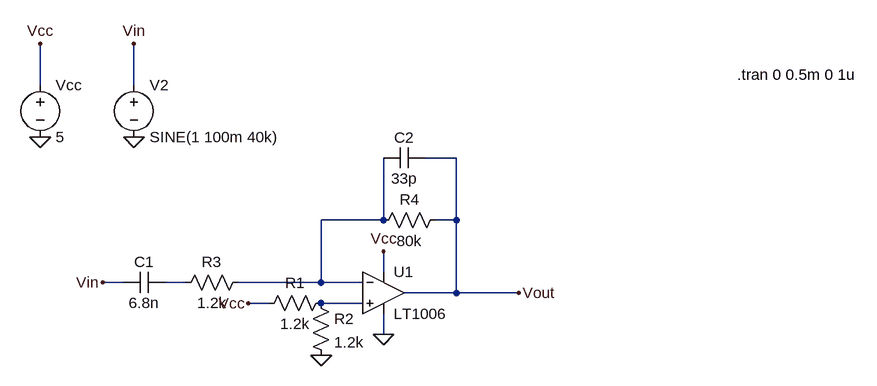
[diagram p0: schematic active_lowpass.asc]
active_lowpass.asc, the LTspice schematic file:
Version 4
SHEET 1 932 680
WIRE -336 96 -336 32
WIRE -192 96 -192 32
WIRE 304 208 256 208
WIRE 192 304 192 208
WIRE 192 304 96 304
WIRE 304 304 304 208
WIRE 304 304 272 304
WIRE 192 384 192 352
WIRE -208 400 -240 400
WIRE -112 400 -144 400
WIRE 96 400 96 304
WIRE 96 400 -32 400
WIRE 160 400 96 400
WIRE 304 416 304 304
WIRE 304 416 224 416
WIRE 400 416 304 416
WIRE 16 432 -16 432
WIRE 160 432 96 432
WIRE 192 480 192 448
FLAG -336 176 0
FLAG -192 176 0
FLAG 96 512 0
FLAG -336 32 Vcc
FLAG -192 32 Vin
FLAG -240 400 Vin
FLAG 400 416 Vout
FLAG 192 352 Vcc
FLAG 192 480 0
FLAG -16 432 Vcc
SYMBOL LT1006 192 352 R0
SYMATTR InstName U1
SYMBOL voltage -336 80 R0
SYMATTR InstName Vcc
SYMATTR Value 5
SYMBOL voltage -192 80 R0
SYMATTR InstName V2
SYMATTR Value SINE(1 100m 40k)
SYMBOL res 112 416 R90
WINDOW 0 0 56 VBottom 2
WINDOW 3 32 56 VTop 2
SYMATTR InstName R1
SYMATTR Value 1.2k
SYMBOL res 80 416 R0
SYMATTR InstName R2
SYMATTR Value 1.2k
SYMBOL res -16 384 R90
WINDOW 0 0 56 VBottom 2
WINDOW 3 32 56 VTop 2
SYMATTR InstName R3
SYMATTR Value 1.2k
SYMBOL res 288 288 R90
WINDOW 0 0 56 VBottom 2
WINDOW 3 32 56 VTop 2
SYMATTR InstName R4
SYMATTR Value 80k
SYMBOL cap -144 384 R90
WINDOW 0 0 32 VBottom 2
WINDOW 3 32 32 VTop 2
SYMATTR InstName C1
SYMATTR Value 6.8n
SYMBOL cap 256 192 R90
WINDOW 0 0 32 VBottom 2
WINDOW 3 32 32 VTop 2
SYMATTR InstName C2
SYMATTR Value 33p
TEXT 736 80 Left 2 !.tran 0 0.5m 0 1u

The netlist it stands for:
* active_lowpass.asc
XU1 N003 N001 Vcc 0 Vout LT1006  ; pins In+ In- V+ V- OUT
Vcc Vcc 0 5
V2 Vin 0 SINE(1 100m 40k)
R1 N003 Vcc 1.2k
R2 N003 0 1.2k
R3 N001 N002 1.2k
R4 Vout N001 80k
C1 N002 Vin 6.8n
C2 Vout N001 33p
.tran 0 0.5m 0 1u
.lib LTC.lib
.backanno
.end